# EAGLE schematic sstv_v1 (EAGLE 7.5.0)
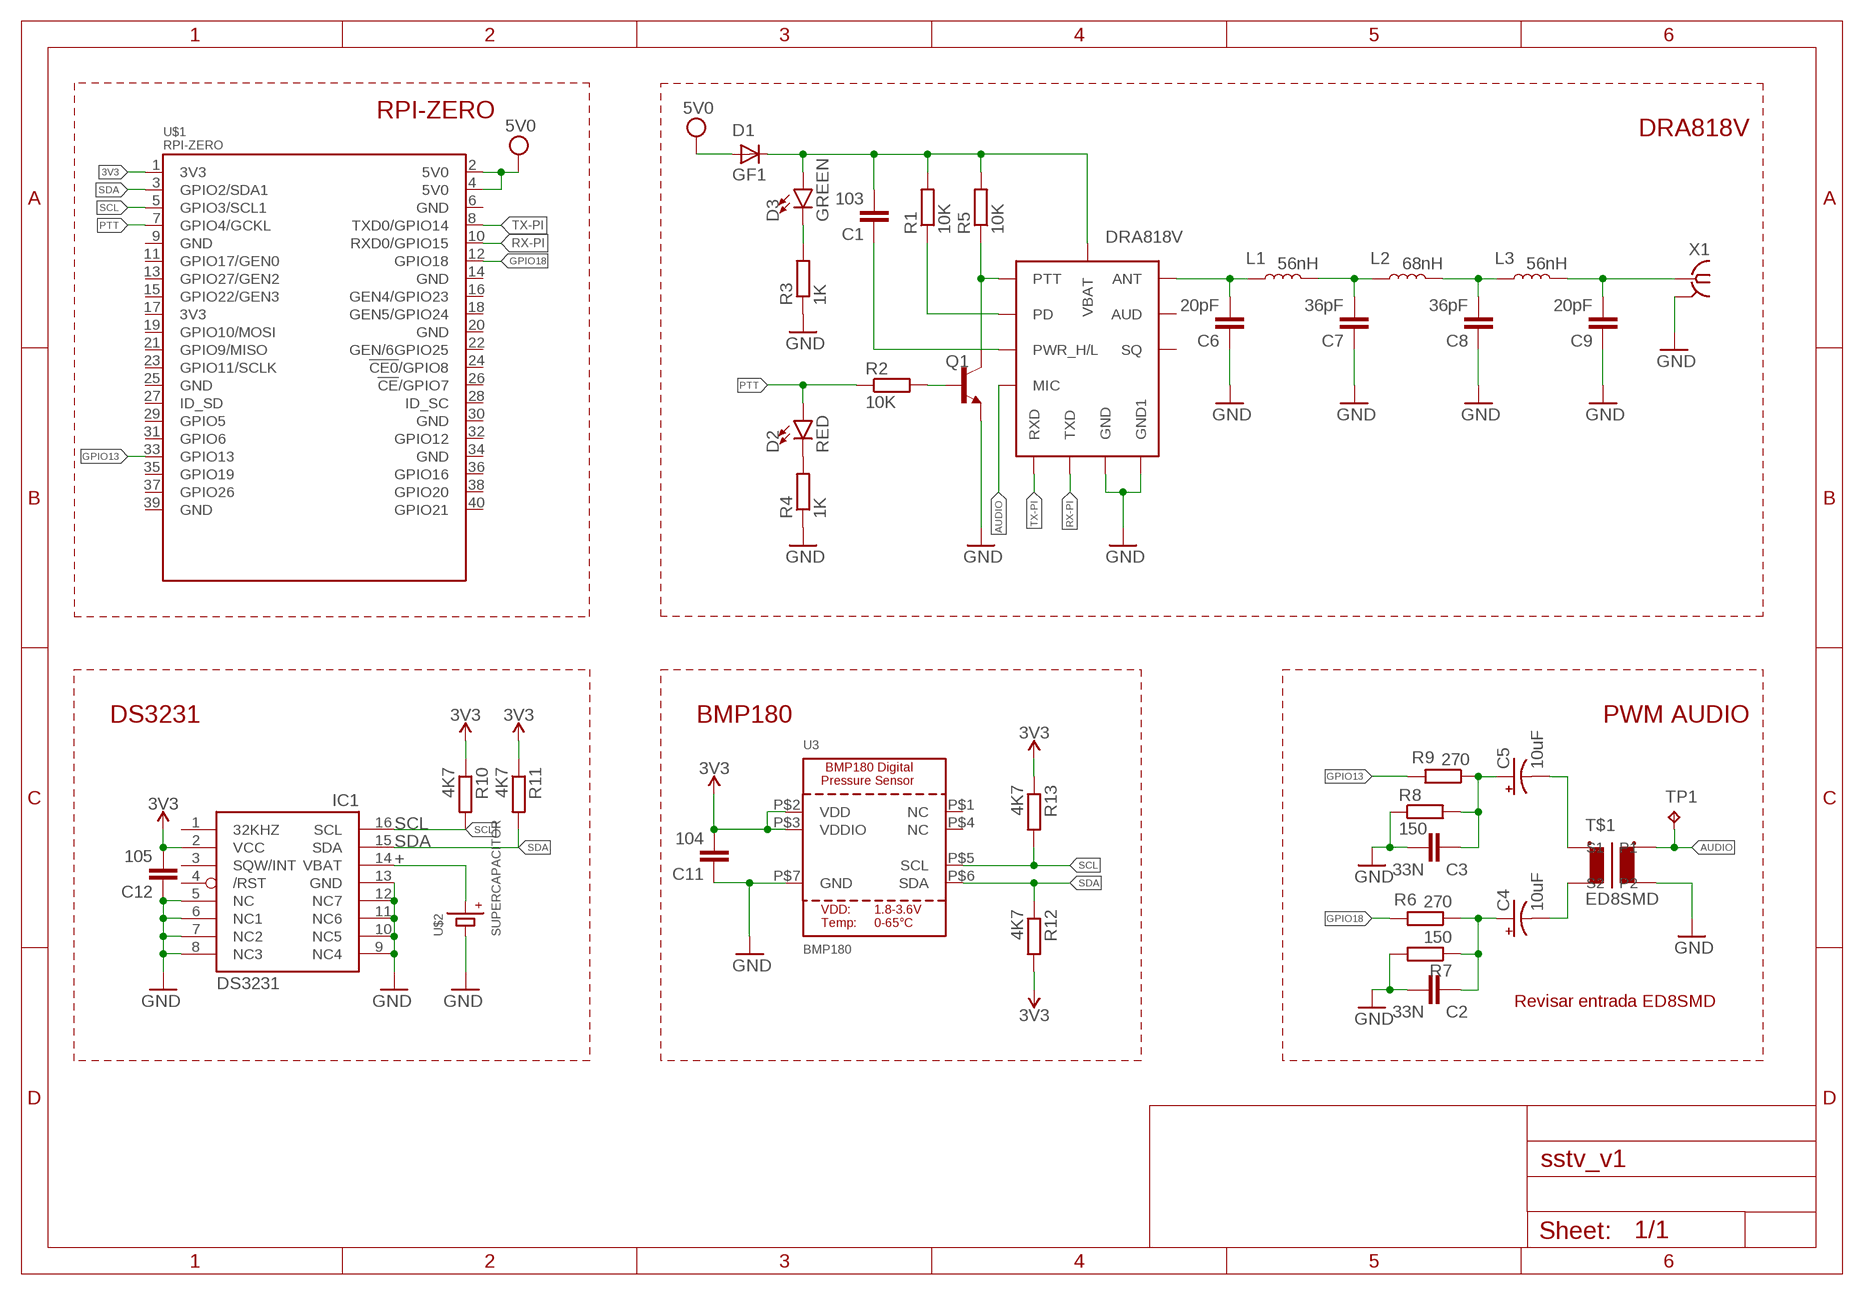
[diagram p0: schematic, sheet 1]

## Parts
C1  103  C-EUC0603K  [C0603K]
C2  33N  C-EUC0603K  [C0603K]
C3  33N  C-EUC0603K  [C0603K]
C4  10uF  10UF-POLAR-0603-6.3V-20%(TANT)  [0603-POLAR]
C5  10uF  10UF-POLAR-0603-6.3V-20%(TANT)  [0603-POLAR]
C6  20pF  C-EUC0603K  [C0603K]
C7  36pF  C-EUC0603K  [C0603K]
C8  36pF  C-EUC0603K  [C0603K]
C9  20pF  C-EUC0603K  [C0603K]
C11  104  C-EUC0603K  [C0603K]
C12  105  C-EUC0603K  [C0603K]
D1  GF1  [SMA-DO214AC]
D2  RED  LED-RED0603  [LED-0603]
D3  GREEN  LED-GREEN0603  [LED-0603]
DRA818V  DRA818V  [DRA8XXZ]
IC1  DS3231/SO  [SO16W]
L1  56nH  INDUCTOR-0603-33NH  [0603]
L2  68nH  INDUCTOR-0603-33NH  [0603]
L3  56nH  INDUCTOR-0603-33NH  [0603]
Q1  600mA/40V  TRANS_NPN-MMBT2222AL  [SOT23-3]
R1  10K  R-EU_R0603  [R0603]
R2  10K  R-EU_R0603  [R0603]
R3  1K  R-EU_R0603  [R0603]
R4  1K  R-EU_R0603  [R0603]
R5  10K  R-EU_R0603  [R0603]
R6  270  R-EU_R0603  [R0603]
R7  150  R-EU_R0603  [R0603]
R8  150  R-EU_R0603  [R0603]
R9  270  R-EU_R0603  [R0603]
R10  4K7  R-EU_R0603  [R0603]
R11  4K7  R-EU_R0603  [R0603]
R12  4K7  R-EU_R0603  [R0603]
R13  4K7  R-EU_R0603  [R0603]
T$1  ED8SMD  [ED8SMD]
TP1  TPB1,27  [B1,27]
U3  BMP180  BMP180EXT  [BMP180_EXTENDED]
U$1  RPI-ZERO  [RASPBERRYPI_BASTELSTUBE_V13_RASPI_BOARD_B+_FULL]
U$2  SUPERCAPACITOR  [SUPERCAPACITOR]
X1  SMA-142-0711-821/826  [J502-ND-142-0711-821/826]

## Nets
3V3: C11.2 C12.2 IC1.2(VCC) R10.1 R11.1 R12.2 R13.1 U3.P$2(VDD) U3.P$3(VDDIO) U$1.1(3V3)
5V0: D1.A U$1.2(5V0) U$1.4(5V0)
+: IC1.14(VBAT) U$2.P$1(+)
-: U$2.P$2(-) ; supply symbol labelled GND
AUDIO: DRA818V.P$18(MIC) T$1.P$3(S1) TP1.TP
GND: C2.2 C3.2 C6.1 C7.1 C8.1 C9.1 C11.1 C12.1 DRA818V.P$9(GND) DRA818V.P$10(GND1) IC1.5(NC) IC1.6(NC1) IC1.7(NC2) IC1.8(NC3) IC1.9(NC4) IC1.10(NC5) IC1.11(NC6) IC1.12(NC7) IC1.13(GND) Q1.2(E) R3.1 R4.1 R7.2 R8.1 T$1.P$4(S2) U3.P$7(GND) X1.G@1 X1.G@2 X1.G@3 X1.G@4
GPIO13: R9.2 U$1.33(GPIO13)
GPIO18: R6.2 U$1.12(GPIO18)
N$1: DRA818V.P$5(PTT) Q1.3(C) R5.1
N$2: DRA818V.P$6(PD) R1.1
N$3: C1.2 D1.K(C) D3.A DRA818V.P$8(VBAT) R1.2 R5.2
N$4: Q1.1(B) R2.2
N$5: D2.C R4.2
N$7: C1.1 DRA818V.P$7(PWR_H/L)
N$8: D3.C R3.2
N$9: C6.2 DRA818V.P$12(ANT) L1.1
N$10: C4.- T$1.P$2(P2)
N$11: C5.- T$1.P$1(P1)
N$12: C7.2 L1.2 L2.1
N$13: C2.1 C4.+ R6.1 R7.1
N$15: C8.2 L2.2 L3.1
N$16: C9.2 L3.2 X1.1
N$17: C3.1 C5.+ R8.2 R9.1
PTT: D2.A R2.1 U$1.7(GPIO4/GCKL)
RX-PI: DRA818V.P$17(TXD) U$1.10(RXD0/GPIO15)
SCL: IC1.16(SCL) R10.2 R13.2 U3.P$5(SCL) U$1.5(GPIO3/SCL1)
SDA: IC1.15(SDA) R11.2 R12.1 U3.P$6(SDA) U$1.3(GPIO2/SDA1)
TX-PI: DRA818V.P$16(RXD) U$1.8(TXD0/GPIO14)
Unconnected: DRA818V.P$1(SQ) DRA818V.P$3(AUD) IC1.1(32KHZ) IC1.3(SQW/INT) IC1.4(/RST) U3.P$1(NC) U3.P$4(NC) U$1.6(GND) U$1.9(GND) U$1.11(GPIO17/GEN0) U$1.13(GPIO27/GEN2) U$1.14(GND) U$1.15(GPIO22/GEN3) U$1.16(GEN4/GPIO23) U$1.17(3V3) U$1.18(GEN5/GPIO24) U$1.19(GPIO10/MOSI) U$1.20(GND) U$1.21(GPIO9/MISO) U$1.22(GEN/6GPIO25) U$1.23(GPIO11/SCLK) U$1.24(!CE0!/GPIO8) U$1.25(GND) U$1.26(!CE!/GPIO7) U$1.27(ID_SD) U$1.28(ID_SC) U$1.29(GPIO5) U$1.30(GND) U$1.31(GPIO6) U$1.32(GPIO12) U$1.34(GND) U$1.35(GPIO19) U$1.36(GPIO16) U$1.37(GPIO26) U$1.38(GPIO20) U$1.39(GND) U$1.40(GPIO21)

## Notes on the sheet
- RPI-ZERO
- DRA818V
- DS3231 | BMP180 | PWM AUDIO
- Revisar entrada ED8SMD

## Library data of the parts
C1-C3 C6-C9 C11 C12 = resistor:C-EU: CAPACITOR, European symbol
C4 C5 = SparkFun-Capacitors:10UF-POLAR: 10.0µF polarized capacitors A capacitor is a passive two-terminal electrical component used to store electrical energy temporarily in an electric field.; PROD_ID: CAP-13210
D1 = diode:GF1: DIODE
D2 = SparkFun-LED:LED-RED: Red SMD LED Used in manufacturing of most products at SparkFun Packages: 0603 - SMD 0603 package [Product Link] <http://docs.avagotech.com/docs/AV02-0551EN> 0603 SMART - SMD 0603 SMART package ( more efficient and expensive)[Product Link] <http://www.osram-os.com/Graphics/XPic2/00077099_0.pdf> 1206 - SMD1206 package [Product Link] <https://www.sparkfun.com/datasheets/DevTools/LilyPad/Q150OVS4.pdff> SparkFun Products: Pro Mini 328 -5V <https://www.sparkfun.com/products/821> RedBoard <https://www.sparkfun.com/products/12757> IOIO-OTG <https://www.sparkfun.com/products/13613>; PROD_ID: DIO-00819
D3 = SparkFun-LED:LED-GREEN: Green SMD LED Used in manufacturing of various products at SparkFun Packages: 0603 - SMD 0603 package [Product Link] <http://www.futureelectronics.com/en/technologies/semiconductors/optoelectronics/leds/Pages/9894312-LTST-C190GKT.aspx?CrossPart=HSMG-C190&IM=0> LilyPad 1206 - SMD1206 LilyPad package [Product Link] <http://www.futureelectronics.com/en/Technologies/Product.aspx?ProductID=IN150NGHARVATEKCORPORATION2049943&IM=0> 1206 - SMD1206 package [Product Link] <http://www.futureelectronics.com/en/technologies/semiconductors/optoelectronics/leds/Pages/8315665-LTST-C150KGKT.aspx?IM=0> 1206 Bottom Mount -SMD 1206 Bottom Mount [Product Link] <http://www.digikey.com/product-detail/en/lite-on-inc/LTST-C230KGKT/160-1456-1-ND/386854> SparkFun Products: Pro Mini 328 -5V <https://www.sparkfun.com/products/821> RedBoard <https://www.sparkfun.com/products/12757> MP3 Trigger <https://www.sparkfun.com/products/13720> Makey Makey <https://www.sparkfun.com/products/11076>; PROD_ID: DIO-00821
DRA818V = DRA818V:DRA818V: VHF FM module
IC1 = adafruit:DS3231
L1-L3 = SparkFun-Coils:INDUCTOR: Inductors Resist changes in electrical current. Basically a coil of wire. SparkFun Products: SparkFun Load Cell Amplifier - HX711 <https://www.sparkfun.com/products/13879> IOIO-OTG - V2.2 <https://www.sparkfun.com/products/13613>; PROD_ID: NDUC-07874; VALUE: 33nH/±5%/500mA
Q1 = SparkFun-DiscreteSemi:TRANS_NPN: NPN transistor Current controlled devices typically used to amplify current or used as a switch. BC547 - COM-08928 <http://www.sparkfun.com/products/8928> (TO-92 45V 100mA) (1.Collector 2.Base 3.Emitter) 2N3904 - COM-00521 <http://www.sparkfun.com/products/521> (TO-92 40V 200mA) (1.Emitter 2.Base 3.Collector) P2N2222A - COM-12852 <http://www.sparkfun.com/products/12852> (TO-92 40V 600mA) (1.Collector 2.Base 3.Emitter); PROD_ID: TRANS-08049
R1-R13 = rcl:R-EU_: RESISTOR, European symbol
T$1 = ED8SMD:ED8SMD
TP1 = testpad:TP: Test pad
U3 = microbuilder:BMP180: BMP180 Digital Pressure Sensor 1.8-3.6V Supply, I2C Interface
U$1 = RPI-Zero:RPI-ZERO
U$2 = supercapacitor:SUPERCAPACITOR
X1 = con-coax:SMA-: SMA 50 Ohm End Launch Jack Receptacle - Round Contact Johnson Components Source: www.johnsoncomponents.com .. J502-ND.pdf; MF: JOHNSON COMPONENTS; MPN: 142-0711-821; OC_FARNELL: 1019328; OC_NEWARK: 16F3627